# EAGLE design M960-1 (EAGLE 6.6.0)

## Sheet 1 of 2
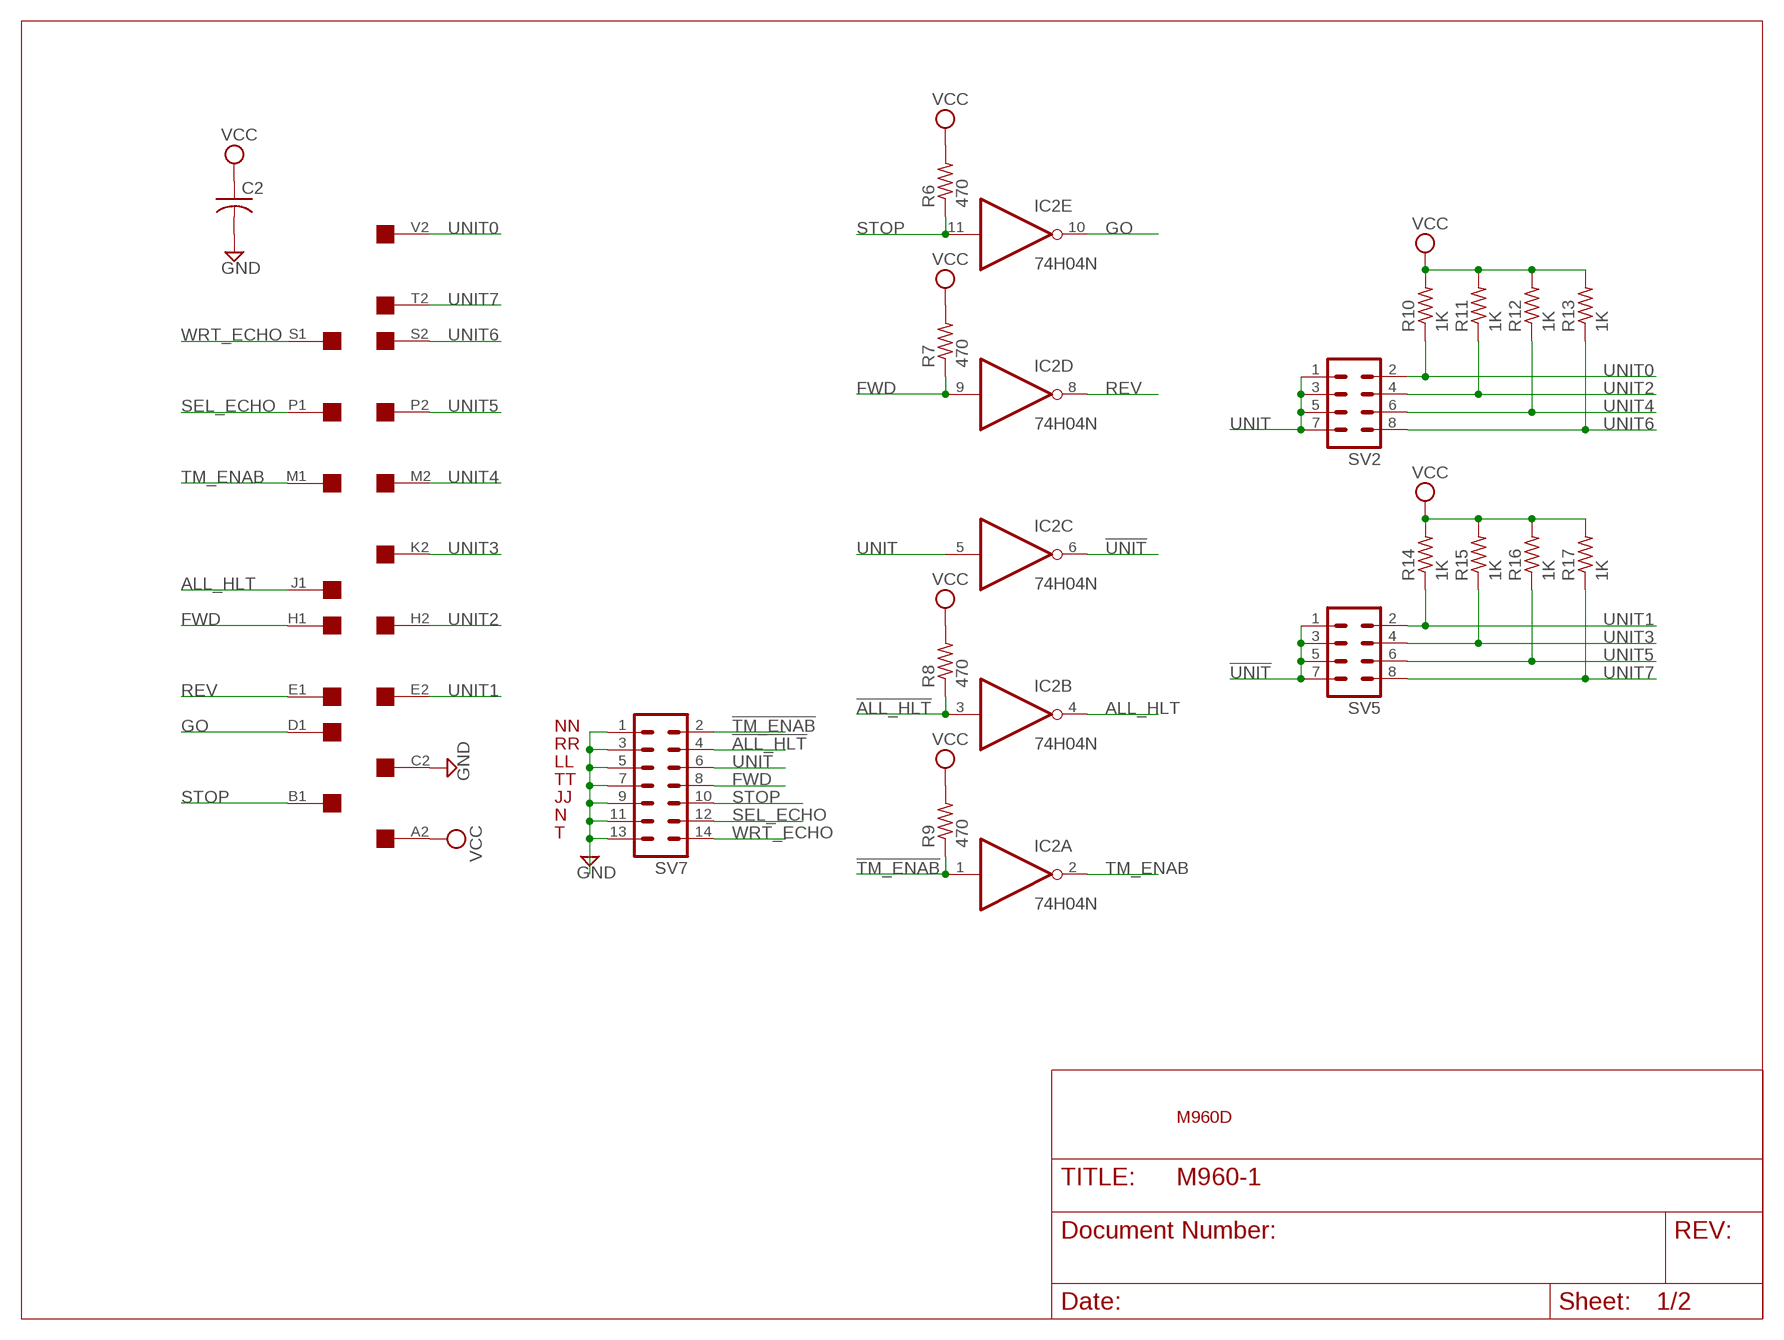
[diagram p0: schematic, sheet 1]

### Parts
C2  C-US050-025X075  [C050-025X075]
IC2  74H04N  7404N  [DIL14]
R6  470  R-US_0207/10  [0207/10]
R7  470  R-US_0207/10  [0207/10]
R8  470  R-US_0207/10  [0207/10]
R9  470  R-US_0207/10  [0207/10]
R10  1K  R-US_0207/10  [0207/10]
R11  1K  R-US_0207/10  [0207/10]
R12  1K  R-US_0207/10  [0207/10]
R13  1K  R-US_0207/10  [0207/10]
R14  1K  R-US_0207/10  [0207/10]
R15  1K  R-US_0207/10  [0207/10]
R16  1K  R-US_0207/10  [0207/10]
R17  1K  R-US_0207/10  [0207/10]
SV2  MA04-2  [MA04-2]
SV5  MA04-2  [MA04-2]
SV7  MA07-2  [MA07-2]
U$3  SINGLE  [EDGE-CON2]

### Nets
!ALL_HLT: IC2.3(B:I) R8.1 SV7.4 ; also sheet 2
!TM_ENAB: IC2.1(A:I) R9.1 SV7.2 ; also sheet 2
!UNIT: IC2.6(C:O) SV5.1 SV5.3 SV5.5 SV5.7
ALL_HLT: IC2.4(B:O) U$3.J1
FWD: IC2.9(D:I) R7.1 SV7.8 U$3.H1 ; also sheet 2
GND: C2.2 SV7.1 SV7.3 SV7.5 SV7.7 SV7.9 SV7.11 SV7.13 U$3.C2 ; also sheet 2
GO: IC2.10(E:O) U$3.D1
REV: IC2.8(D:O) U$3.E1
SEL_ECHO: SV7.12 U$3.P1 ; also sheet 2
STOP: IC2.11(E:I) R6.1 SV7.10 U$3.B1 ; also sheet 2
TM_ENAB: IC2.2(A:O) U$3.M1
UNIT: IC2.5(C:I) SV2.1 SV2.3 SV2.5 SV2.7 SV7.6 ; also sheet 2
UNIT0: R10.1 SV2.2 U$3.V2
UNIT1: R14.1 SV5.2 U$3.E2
UNIT2: R11.1 SV2.4 U$3.H2
UNIT3: R15.1 SV5.4 U$3.K2
UNIT4: R12.1 SV2.6 U$3.M2
UNIT5: R16.1 SV5.6 U$3.P2
UNIT6: R13.1 SV2.8 U$3.S2
UNIT7: R17.1 SV5.8 U$3.T2
VCC: C2.1 R6.2 R7.2 R8.2 R9.2 R10.2 R11.2 R12.2 R13.2 R14.2 R15.2 R16.2 R17.2 U$3.A2 ; also sheet 2
WRT_ECHO: SV7.14 U$3.S1 ; also sheet 2
Unconnected: IC2.12(F:O) IC2.13(F:I) U$3.A1 U$3.B2 U$3.C1 U$3.D2 U$3.F1 U$3.F2 U$3.J2 U$3.K1 U$3.L1 U$3.L2 U$3.N1 U$3.N2 U$3.R1 U$3.R2 U$3.T1 U$3.U1 U$3.U2 U$3.V1

### Notes on the sheet
- NN
- RR
- LL
- TT
- JJ
- N
- T
- M960D

## Sheet 2 of 2
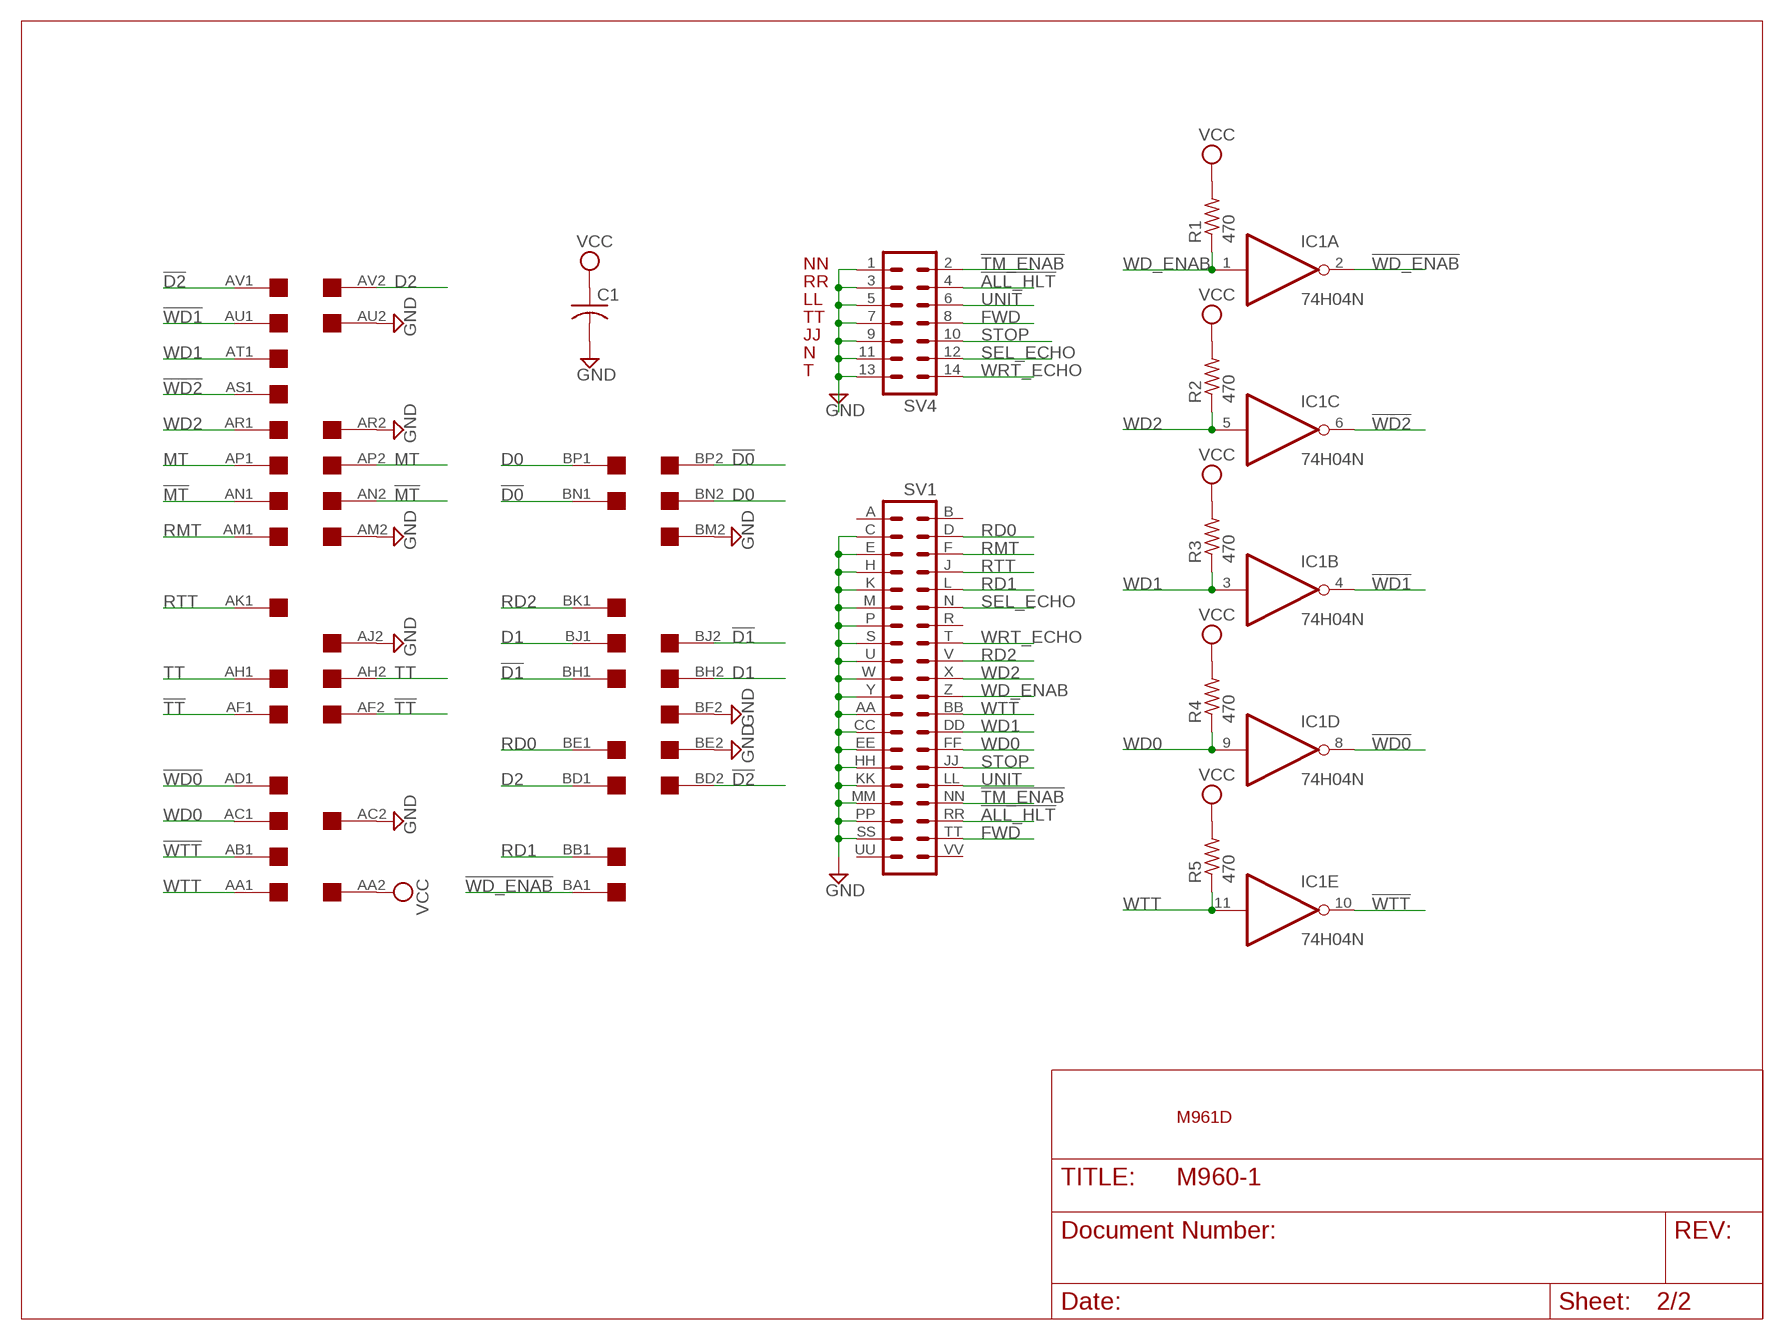
[diagram p1: schematic, sheet 2]

### Parts
C1  C-US050-025X075  [C050-025X075]
EDGE$1  DOUBLE  [EDGE-CON4]
IC1  74H04N  7404N  [DIL14]
R1  470  R-US_0207/10  [0207/10]
R2  470  R-US_0207/10  [0207/10]
R3  470  R-US_0207/10  [0207/10]
R4  470  R-US_0207/10  [0207/10]
R5  470  R-US_0207/10  [0207/10]
SV1  DEC40PINV  [DEC40PINV]
SV4  MA07-2  [MA07-2]

### Nets
!ALL_HLT: SV1.RR SV4.4 ; also sheet 1
!D0: EDGE$1.BN1 EDGE$1.BP2
!D1: EDGE$1.BH1 EDGE$1.BJ2
!D2: EDGE$1.AV1 EDGE$1.BD2
!MT: EDGE$1.AN1 EDGE$1.AN2
!TM_ENAB: SV1.NN SV4.2 ; also sheet 1
!TT: EDGE$1.AF1 EDGE$1.AF2
!WD0: EDGE$1.AD1 IC1.8(D:O)
!WD1: EDGE$1.AU1 IC1.4(B:O)
!WD2: EDGE$1.AS1 IC1.6(C:O)
!WD_ENAB: EDGE$1.BA1 IC1.2(A:O)
!WTT: EDGE$1.AB1 IC1.10(E:O)
D0: EDGE$1.BN2 EDGE$1.BP1
D1: EDGE$1.BH2 EDGE$1.BJ1
D2: EDGE$1.AV2 EDGE$1.BD1
FWD: SV1.TT SV4.8 ; also sheet 1
GND: C1.2 EDGE$1.AC2 EDGE$1.AJ2 EDGE$1.AM2 EDGE$1.AR2 EDGE$1.AU2 EDGE$1.BE2 EDGE$1.BF2 EDGE$1.BM2 SV1.AA SV1.C SV1.CC SV1.E SV1.EE SV1.H SV1.HH SV1.K SV1.KK SV1.M SV1.MM SV1.P SV1.PP SV1.S SV1.SS SV1.U SV1.W SV1.Y SV4.1 SV4.3 SV4.5 SV4.7 SV4.9 SV4.11 SV4.13 ; also sheet 1
MT: EDGE$1.AP1 EDGE$1.AP2
RD0: EDGE$1.BE1 SV1.D
RD1: EDGE$1.BB1 SV1.L
RD2: EDGE$1.BK1 SV1.V
RMT: EDGE$1.AM1 SV1.F
RTT: EDGE$1.AK1 SV1.J
SEL_ECHO: SV1.N SV4.12 ; also sheet 1
STOP: SV1.JJ SV4.10 ; also sheet 1
TT: EDGE$1.AH1 EDGE$1.AH2
UNIT: SV1.LL SV4.6 ; also sheet 1
VCC: C1.1 EDGE$1.AA2 R1.2 R2.2 R3.2 R4.2 R5.2 ; also sheet 1
WD0: EDGE$1.AC1 IC1.9(D:I) R4.1 SV1.FF
WD1: EDGE$1.AT1 IC1.3(B:I) R3.1 SV1.DD
WD2: EDGE$1.AR1 IC1.5(C:I) R2.1 SV1.X
WD_ENAB: IC1.1(A:I) R1.1 SV1.Z
WRT_ECHO: SV1.T SV4.14 ; also sheet 1
WTT: EDGE$1.AA1 IC1.11(E:I) R5.1 SV1.BB
Unconnected: EDGE$1.AB2 EDGE$1.AD2 EDGE$1.AE1 EDGE$1.AE2 EDGE$1.AJ1 EDGE$1.AK2 EDGE$1.AL1 EDGE$1.AL2 EDGE$1.AS2 EDGE$1.AT2 EDGE$1.BA2 EDGE$1.BB2 EDGE$1.BC1 EDGE$1.BC2 EDGE$1.BF1 EDGE$1.BK2 EDGE$1.BL1 EDGE$1.BL2 EDGE$1.BM1 EDGE$1.BR1 EDGE$1.BR2 EDGE$1.BS1 EDGE$1.BS2 EDGE$1.BT1 EDGE$1.BT2 EDGE$1.BU1 EDGE$1.BU2 EDGE$1.BV1 EDGE$1.BV2 IC1.12(F:O) IC1.13(F:I) SV1.A SV1.B SV1.R SV1.UU SV1.VV

### Notes on the sheet
- NN
- RR
- LL
- TT
- JJ
- N
- T
- M961D

## Power pins joined to a net without a drawn wire
GND: IC1.7(P:GND) IC2.7(P:GND)
VCC: IC1.14(P:VCC) IC2.14(P:VCC)

## Library data of the parts
C1 C2 = rcl:C-US: CAPACITOR, American symbol
EDGE$1 = dec-con:DOUBLE: Double-Height DEC board
IC1 IC2 = 74xx-us:74*04: Hex INVERTER
R1-R17 = rcl:R-US_: RESISTOR, American symbol
SV1 = dec-con:DEC40PIN: PIN HEADER
SV2 SV5 = con-lstb:MA04-2: PIN HEADER; OC_FARNELL: unknown; OC_NEWARK: unknown
SV4 SV7 = con-lstb:MA07-2: PIN HEADER; OC_FARNELL: unknown; OC_NEWARK: unknown
U$3 = dec-con:SINGLE: Single-Height DEC board

## Net classes
1 Supply: width 0.813 mm

## Board
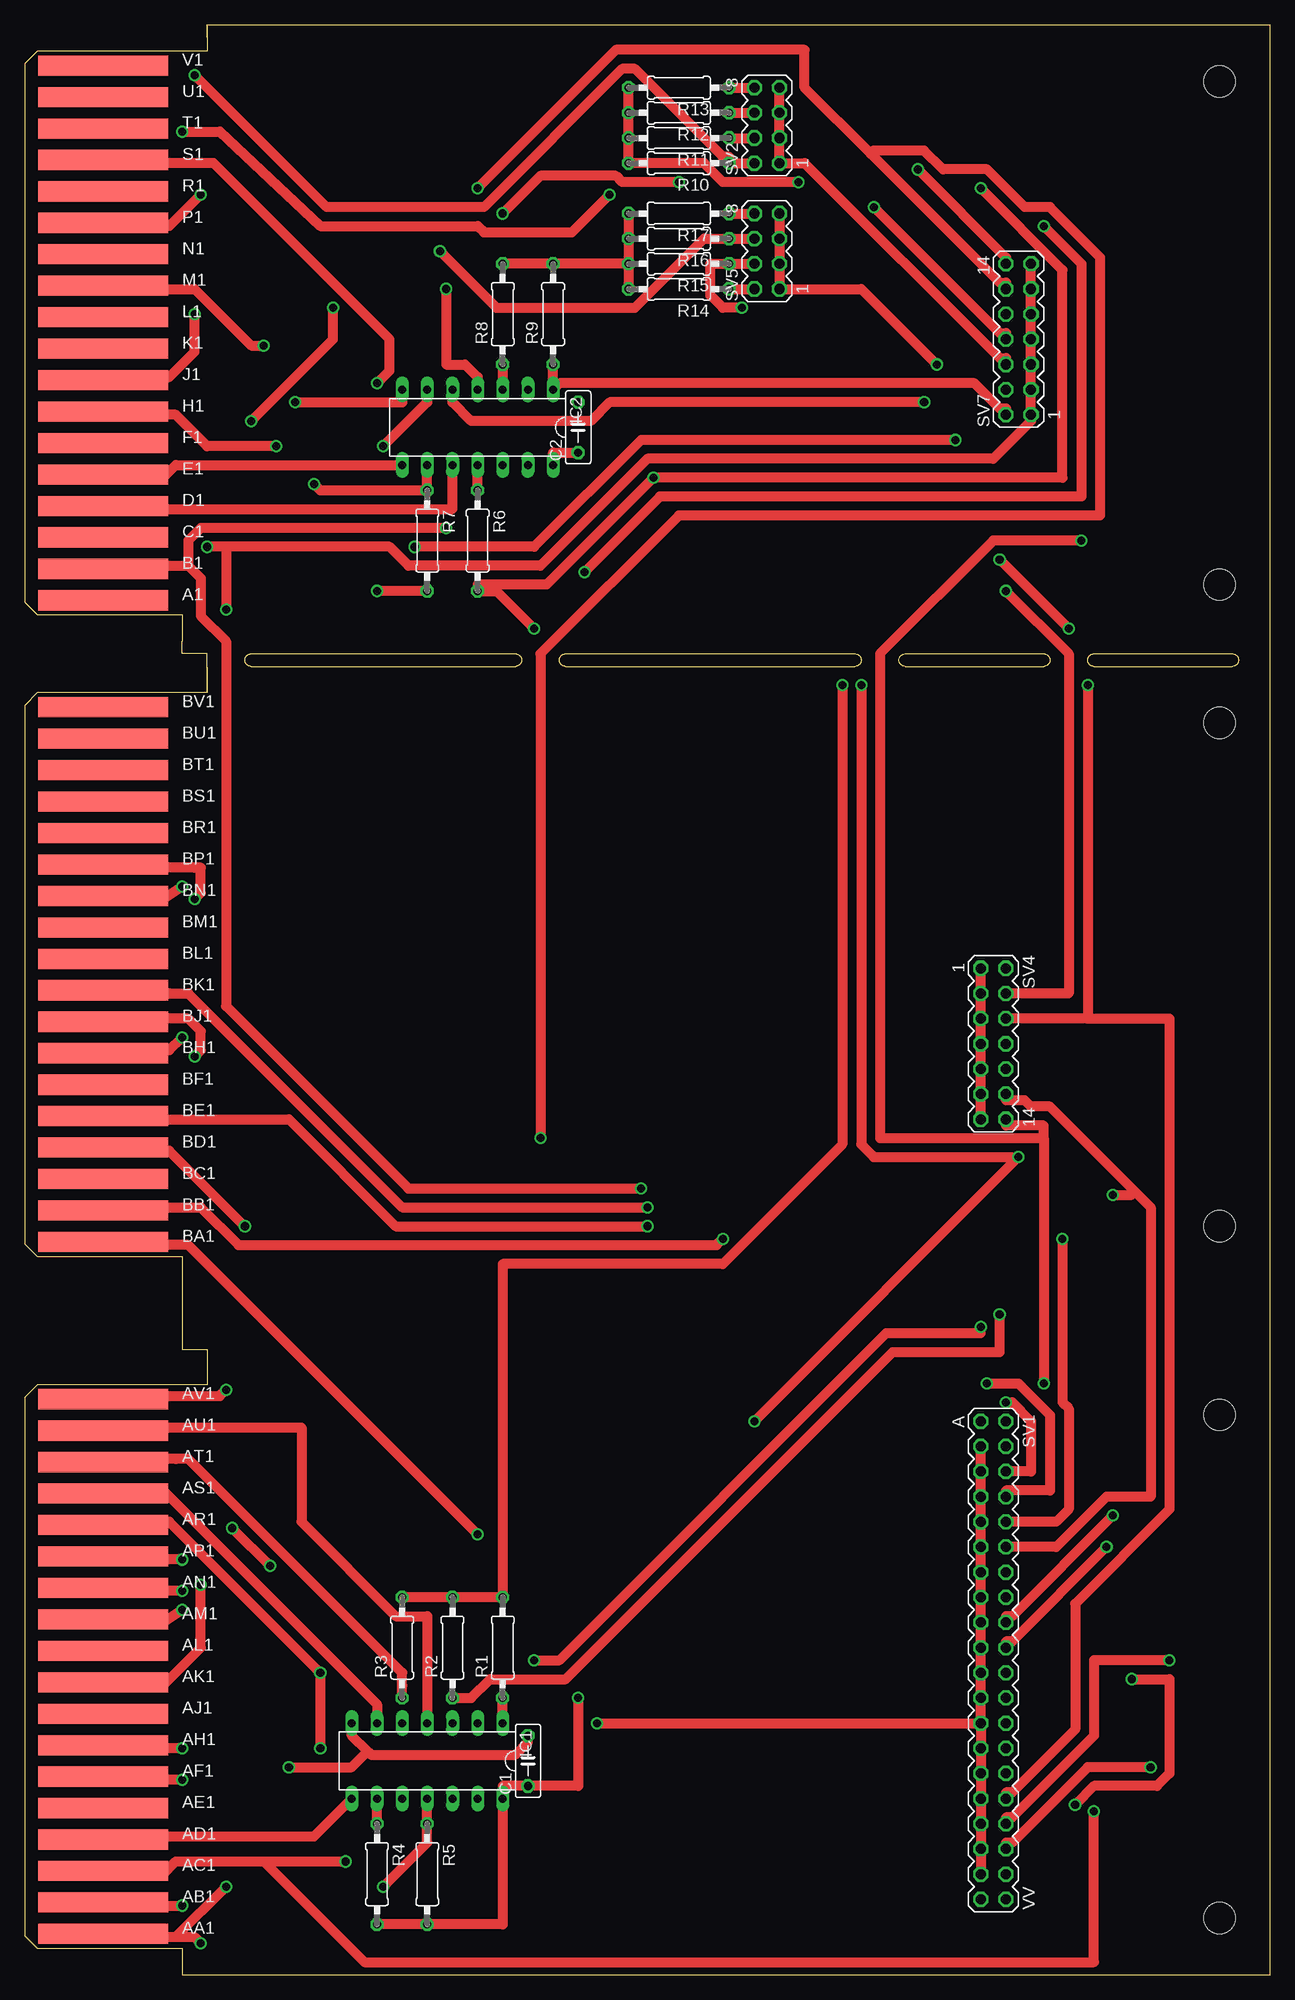
[diagram p2: board, top side]
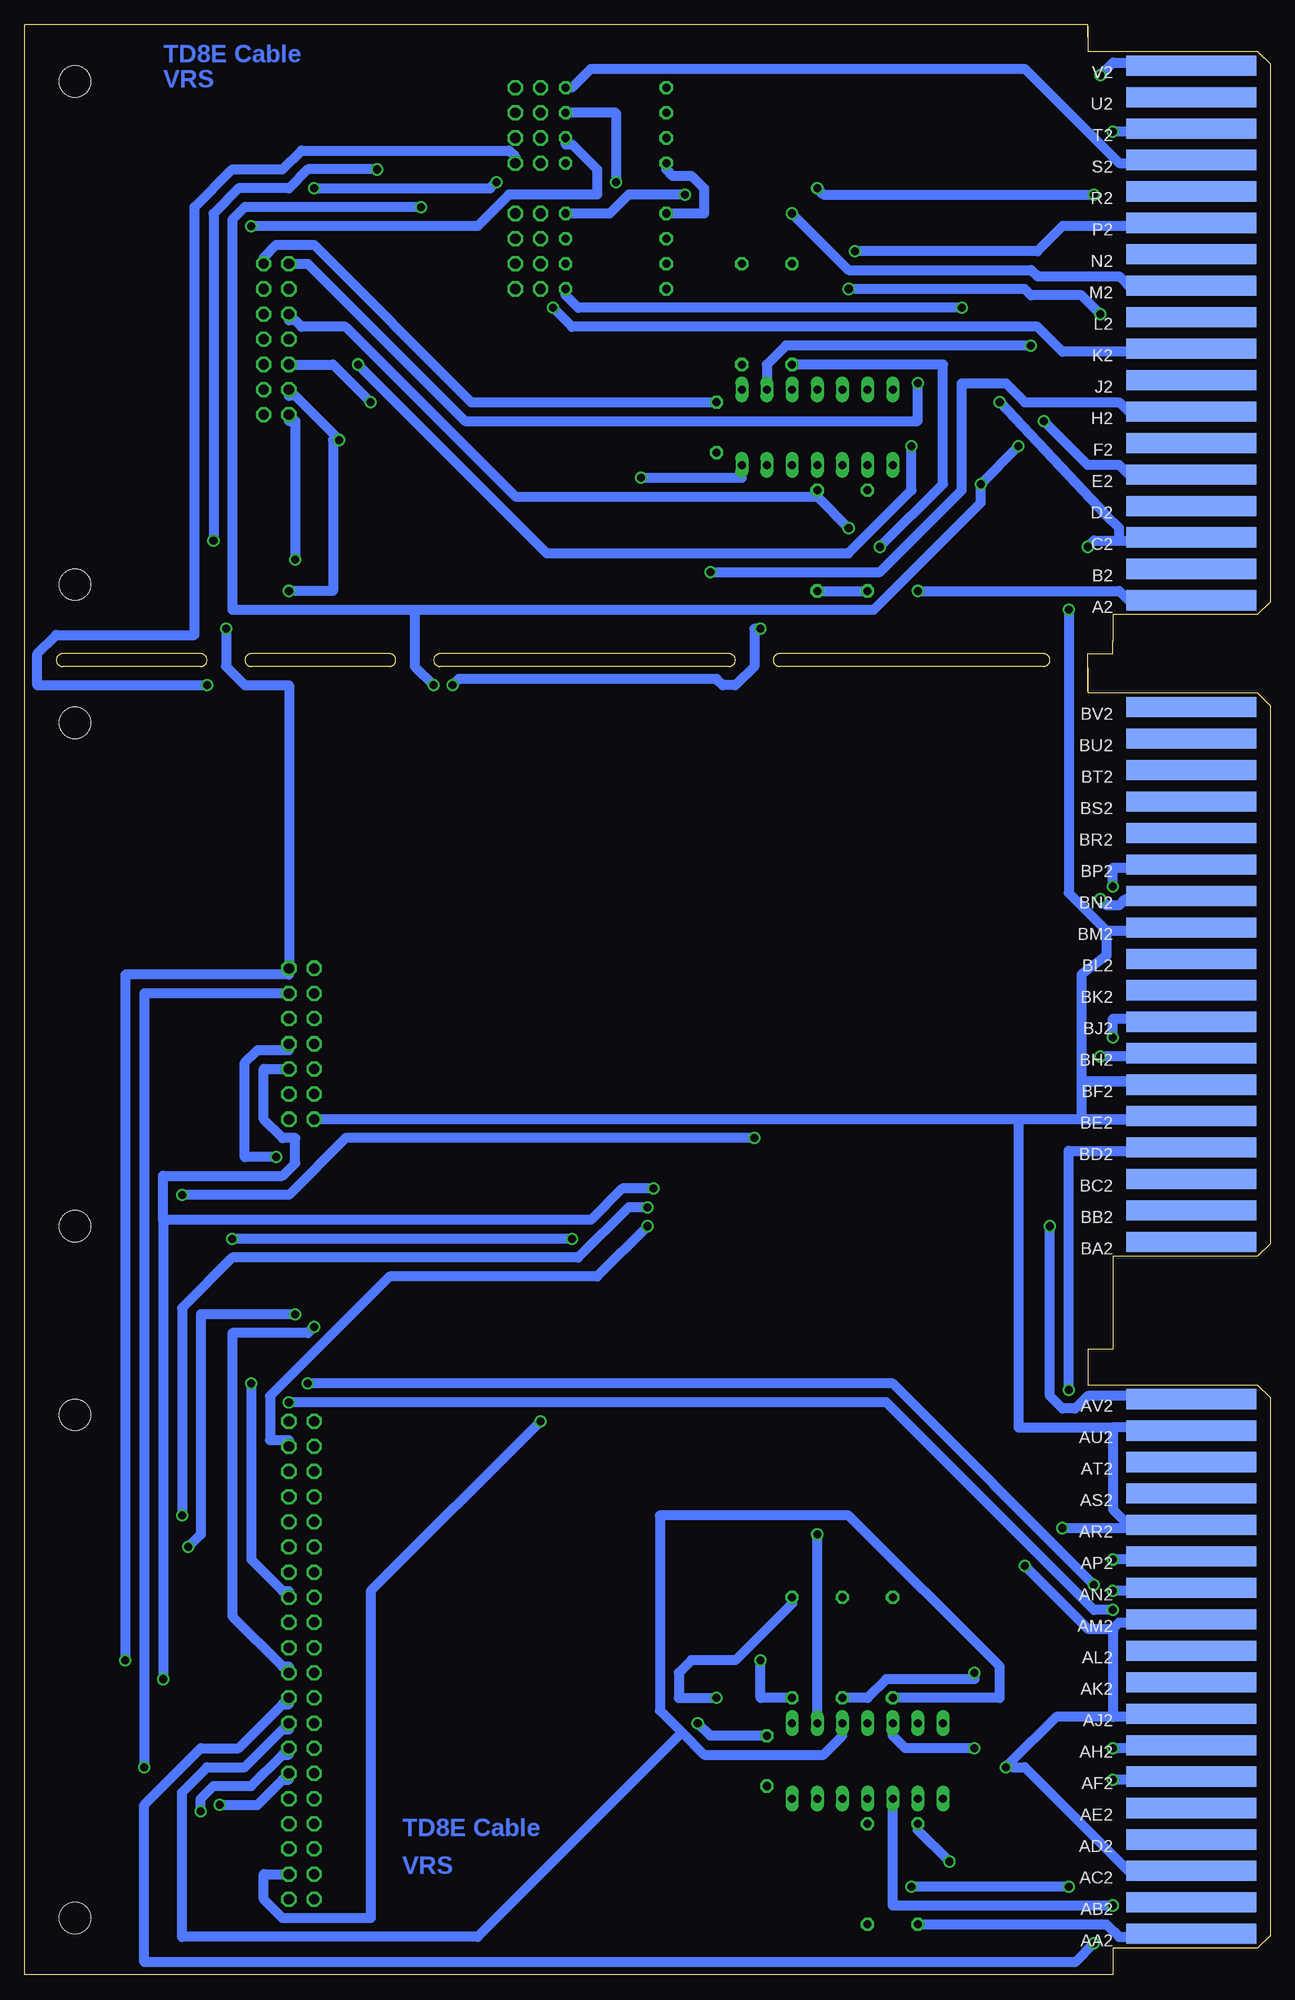
[diagram p3: board, bottom side, seen from below]

Size 125.73 x 196.85 mm. Coordinates in mm from the lower left corner, seen from the top.
Outline: 18.41,195.58 18.41,196.85 125.73,196.85 125.73,0 15.88,0
Outline: 15.88,134.62 15.88,133.35 18.41,133.35 18.41,129.54
Outline: 22.86,133.35 49.53,133.35 arc-180 49.53,132.08 22.86,132.08 arc-180 22.86,133.35
Outline: 54.61,133.35 83.82,133.35 arc-180 83.82,132.08 54.61,132.08 arc-180 54.61,133.35
Outline: 88.9,133.35 102.87,133.35 arc-180 102.87,132.08 88.9,132.08 arc-180 88.9,133.35
Outline: 107.95,133.35 121.92,133.35 arc-180 121.92,132.08 107.95,132.08 arc-180 107.95,133.35
Copper layers (1+16): Top 0.035mm / dielectric 1.5mm / Bottom 0.035mm
Design rules "16mils": minimum track width 16mil, minimum drill 32mil, track to track 15mil, track to pad 10mil, pad to pad 10mil, via to via 10mil, smd to smd 10mil, copper to edge 13mil, drill to drill 10mil, minimum pad ring 10mil, minimum via ring 8mil, stop-mask expansion 0mil, vias tented up to drill 0mil, thermal gap 10mil
Holes 3.17 mm at 120.65,191.13 120.65,140.34 120.65,126.36 120.65,75.56 120.65,56.52 120.65,5.71
tRestrict: area 116.8,137.2 to 125.7,194.3; area 116.8,72.4 to 125.7,129.5; area 116.8,2.5 to 125.7,59.7
bRestrict: area 116.8,137.2 to 125.7,194.3; area 116.8,72.4 to 125.7,129.5; area 116.8,2.5 to 125.7,59.7

### Footprints (pad centres in the part's own frame; a part is rotated, then mirrored left to right if it is on the bottom)
C050-025X075 = drill 0.813 octagon: 1 -2.54,0; 2 2.54,0
EDGE-CON4 = smd 13.106 x 2.032: AA1 7.938,4.128; AB1 7.938,7.303; AC1 7.938,10.477; AD1 7.938,13.652; AE1 7.938,16.828; AF1 7.938,20.003; AH1 7.938,23.177; AJ1 7.938,26.352; AK1 7.938,29.527; AL1 7.938,32.703; AM1 7.938,35.877; AN1 7.938,39.053; AP1 7.938,42.227; AR1 7.938,45.403; AS1 7.938,48.578; AT1 7.938,51.752; AU1 7.938,54.928; AV1 7.938,58.102; BA1 7.938,73.978; BB1 7.938,77.153; BC1 7.938,80.328; BD1 7.938,83.502; BE1 7.938,86.677; BF1 7.938,89.853; BH1 7.938,93.028; BJ1 7.938,96.203; BK1 7.938,99.377; BL1 7.938,102.552; BM1 7.938,105.728; BN1 7.938,108.903; BP1 7.938,112.078; BR1 7.938,115.252; BS1 7.938,118.427; BT1 7.938,121.603; BU1 7.938,124.778; BV1 7.938,127.953 | smd 13.106 x 2.032 bottom: AA2 7.938,4.128; AB2 7.938,7.303; AC2 7.938,10.477; AD2 7.938,13.652; AE2 7.938,16.828; AF2 7.938,20.003; AH2 7.938,23.177; AJ2 7.938,26.352; AK2 7.938,29.527; AL2 7.938,32.703; AM2 7.938,35.877; AN2 7.938,39.053; AP2 7.938,42.227; AR2 7.938,45.403; AS2 7.938,48.578; AT2 7.938,51.752; AU2 7.938,54.928; AV2 7.938,58.102; BA2 7.938,73.978; BB2 7.938,77.153; BC2 7.938,80.328; BD2 7.938,83.502; BE2 7.938,86.677; BF2 7.938,89.853; BH2 7.938,93.028; BJ2 7.938,96.203; BK2 7.938,99.377; BL2 7.938,102.552; BM2 7.938,105.728; BN2 7.938,108.903; BP2 7.938,112.078; BR2 7.938,115.252; BS2 7.938,118.427; BT2 7.938,121.603; BU2 7.938,124.778; BV2 7.938,127.953
DIL14 = drill 0.813 long: 1 -7.62,-3.81; 2 -5.08,-3.81; 3 -2.54,-3.81; 4 0,-3.81; 5 2.54,-3.81; 6 5.08,-3.81; 7 7.62,-3.81; 8 7.62,3.81; 9 5.08,3.81; 10 2.54,3.81; 11 0,3.81; 12 -2.54,3.81; 13 -5.08,3.81; 14 -7.62,3.81
0207/10 = drill 0.813 octagon: 1 -5.08,0; 2 5.08,0
DEC40PINV = drill 1.016 octagon: A -24.13,-1.27; AA 3.81,-1.27; B -24.13,1.27; BB 3.81,1.27; C -21.59,-1.27; CC 6.35,-1.27; D -21.59,1.27; DD 6.35,1.27; E -19.05,-1.27; EE 8.89,-1.27; F -19.05,1.27; FF 8.89,1.27; H -16.51,-1.27; HH 11.43,-1.27; J -16.51,1.27; JJ 11.43,1.27; K -13.97,-1.27; KK 13.97,-1.27; L -13.97,1.27; LL 13.97,1.27; M -11.43,-1.27; MM 16.51,-1.27; N -11.43,1.27; NN 16.51,1.27; P -8.89,-1.27; PP 19.05,-1.27; R -8.89,1.27; RR 19.05,1.27; S -6.35,-1.27; SS 21.59,-1.27; T -6.35,1.27; TT 21.59,1.27; U -3.81,-1.27; UU 24.13,-1.27; V -3.81,1.27; VV 24.13,1.27; W -1.27,-1.27; X -1.27,1.27; Y 1.27,-1.27; Z 1.27,1.27
MA04-2 = drill 1.016 octagon: 1 -3.81,-1.27; 2 -3.81,1.27; 3 -1.27,-1.27; 4 -1.27,1.27; 5 1.27,-1.27; 6 1.27,1.27; 7 3.81,-1.27; 8 3.81,1.27
MA07-2 = drill 1.016 octagon: 1 -7.62,-1.27; 2 -7.62,1.27; 3 -5.08,-1.27; 4 -5.08,1.27; 5 -2.54,-1.27; 6 -2.54,1.27; 7 0,-1.27; 8 0,1.27; 9 2.54,-1.27; 10 2.54,1.27; 11 5.08,-1.27; 12 5.08,1.27; 13 7.62,-1.27; 14 7.62,1.27
EDGE-CON2 = smd 13.106 x 2.032: A1 7.938,4.128; B1 7.938,7.303; C1 7.938,10.477; D1 7.938,13.652; E1 7.938,16.828; F1 7.938,20.003; H1 7.938,23.177; J1 7.938,26.352; K1 7.938,29.527; L1 7.938,32.703; M1 7.938,35.877; N1 7.938,39.053; P1 7.938,42.227; R1 7.938,45.403; S1 7.938,48.578; T1 7.938,51.752; U1 7.938,54.928; V1 7.938,58.102 | smd 13.106 x 2.032 bottom: A2 7.938,4.128; B2 7.938,7.303; C2 7.938,10.477; D2 7.938,13.652; E2 7.938,16.828; F2 7.938,20.003; H2 7.938,23.177; J2 7.938,26.352; K2 7.938,29.527; L2 7.938,32.703; M2 7.938,35.877; N2 7.938,39.053; P2 7.938,42.227; R2 7.938,45.403; S2 7.938,48.578; T2 7.938,51.752; U2 7.938,54.928; V2 7.938,58.102

### Placement (x,y rotation side)
C1  50.8,21.59 90 top
C2  55.88,156.21 90 top
EDGE$1  0,0 0 top
IC1  40.64,21.59 180 top
IC2  45.72,156.21 180 top
R1  48.26,33.02 90 top
R2  43.18,33.02 90 top
R3  38.1,33.02 90 top
R4  35.56,10.16 270 top
R5  40.64,10.16 270 top
R6  45.72,144.78 270 top
R7  40.64,144.78 270 top
R8  48.26,167.64 90 top
R9  53.34,167.64 90 top
R10  66.04,182.88 180 top
R11  66.04,185.42 180 top
R12  66.04,187.96 180 top
R13  66.04,190.5 180 top
R14  66.04,170.18 180 top
R15  66.04,172.72 180 top
R16  66.04,175.26 180 top
R17  66.04,177.8 180 top
SV1  97.79,31.75 270 top
SV2  74.93,186.69 90 top
SV4  97.79,93.98 270 top
SV5  74.93,173.99 90 top
SV7  100.33,165.1 90 top
U$3  0,134.62 0 top

### Tracks (layer width: path | path; a pad name or v marks a point on that pad's centre or on a via)
!ALL_HLT  (via drill 0.81)
  Top 1.016: R8.1 IC2.3 | v93.98,154.94 62.23,154.94 51.44,144.15 v39.37,144.15 | v113.67,20.95 107.31,20.95 99.69,13.34 99.06,13.34 SV1.RR | v99.06,139.7 105.41,133.35 105.41,99.06 SV4.4
  Bottom 1.016: 94.3,155.26 98.42,159.38 99.06,159.38 SV7.4 | 94.3,155.26 v93.98,154.94 | v39.37,144.15 33.02,150.5 33.02,162.56 R8.1 | v113.67,20.95 113.67,99.06 SV4.4 | v99.06,139.7 94.61,139.7 94.61,154.94 94.3,155.26
!D0  (via drill 0.81)
  Top 1.016: v15.88,109.86 13.97,108.58 EDGE$1.BN1
  Bottom 1.016: v15.88,109.86 15.88,111.76 13.97,111.76 EDGE$1.BP2
!D1  (via drill 0.81)
  Top 1.016: v15.88,94.61 14.61,93.34 13.97,93.34 EDGE$1.BH1
  Bottom 1.016: v15.88,94.61 15.88,96.52 13.97,96.52 EDGE$1.BJ2
!D2  (via drill 0.81)
  Top 1.016: v20.32,59.05 19.68,58.42 13.97,58.42 EDGE$1.AV1
  Bottom 1.016: v20.32,59.05 20.32,83.19 13.97,83.19 EDGE$1.BD2
!MT  (via drill 0.81)
  Top 1.016: v15.88,38.73 13.97,38.73 EDGE$1.AN2
  Bottom 1.016: v15.88,38.73 13.97,38.73 EDGE$1.AN2
!TM_ENAB  (via drill 0.81)
  Top 1.016: R9.1 IC2.1 53.98,160.66 95.89,160.66 98.42,158.12 99.06,158.12 SV7.2 | v115.57,31.75 107.95,31.75 107.95,24.13 99.69,15.88 99.06,15.88 SV1.NN | v98.42,142.88 v105.41,135.89
  Bottom 1.016: v115.57,31.75 115.57,100.97 99.06,100.97 SV4.2 99.06,130.18 103.5,130.18 105.41,132.08 v105.41,135.89 | v98.42,142.88 98.42,156.84 99.06,156.84 SV7.2
!TT  (via drill 0.81)
  Top 1.016: v15.88,19.68 13.97,19.68 EDGE$1.AF2
  Bottom 1.016: v15.88,19.68 13.97,19.68 EDGE$1.AF2
!UNIT  (via drill 0.81)
  Top 1.016: v36.2,154.31 40.64,158.75 IC2.6 | v92.08,162.56 84.45,170.18 SV5.1 SV5.3 SV5.5 SV5.7
  Bottom 1.016: v36.2,154.31 36.2,149.86 42.55,143.51 73.03,143.51 v92.08,162.56
!WD0
  Top 1.016: IC1.8 29.21,13.97 13.97,13.97 EDGE$1.AD1
!WD1
  Top 1.016: IC1.4 40.64,36.2 37.47,36.2 27.94,45.72 27.94,55.24 13.97,55.24 EDGE$1.AU1
!WD2
  Top 1.016: IC1.6 35.56,27.3 13.97,48.9 EDGE$1.AS1
!WD_ENAB  (via drill 0.81)
  Top 1.016: v45.72,44.45 16.51,73.66 13.97,73.66 EDGE$1.BA1
  Bottom 1.016: IC1.2 v45.72,44.45
!WTT  (via drill 0.81)
  Top 1.016: v15.88,6.99 13.97,6.99 EDGE$1.AB1
  Bottom 1.016: v15.88,6.99 38.1,6.99 IC1.10
ALL_HLT  (via drill 0.81)
  Top 1.016: v17.14,167.64 17.14,163.83 14.61,161.29 13.97,161.29 U$3.J1 | v42.55,170.18 42.55,162.56 44.45,162.56 45.72,161.29 IC2.4
  Bottom 1.016: v17.14,167.64 19.05,169.54 24.13,169.54 24.77,170.18 v42.55,170.18
D0  (via drill 0.81)
  Top 1.016: v17.14,108.58 17.78,109.22 17.78,111.76 17.14,111.76 13.97,111.76 EDGE$1.BP1
  Bottom 1.016: v17.14,108.58 16.51,107.95 15.24,107.95 14.61,108.58 13.97,108.58 EDGE$1.BN2
D1  (via drill 0.81)
  Top 1.016: v17.14,92.71 17.78,93.34 17.78,95.25 16.51,96.52 13.97,96.52 EDGE$1.BJ1
  Bottom 1.016: v17.14,92.71 13.97,92.71 EDGE$1.BH2
D2  (via drill 0.81)
  Top 1.016: v22.23,75.56 14.61,83.19 13.34,83.19 EDGE$1.BD1
  Bottom 1.016: v22.23,75.56 22.23,58.42 20.95,57.15 19.68,57.15 18.41,58.42 13.34,58.42 EDGE$1.AV2
FWD  (via drill 0.81)
  Top 1.016: v25.4,154.31 18.41,154.31 15.24,157.48 13.97,157.48 U$3.H1 | v29.21,150.5 29.84,149.86 R7.1 IC2.9 | v85.72,178.44 98.42,165.74 99.06,165.74 SV7.8 | 100.01,82.23 v73.66,55.88 | 100.01,82.23 v100.33,82.55 | v84.45,130.18 84.45,83.82 85.72,82.55 99.69,82.55 100.01,82.23
  Bottom 1.016: v25.4,154.31 v29.21,150.5 29.21,148.59 40.01,137.79 86.36,137.79 | v85.72,178.44 103.5,178.44 104.78,177.16 104.78,137.79 86.36,137.79 | v100.33,82.55 103.5,82.55 103.5,92.08 102.23,93.34 99.06,93.34 SV4.8 | v73.66,55.88 90.81,38.73 90.81,5.71 99.69,5.71 101.6,7.62 101.6,10.16 SV1.TT | v84.45,130.18 86.36,132.08 86.36,137.79
GND  (via drill 0.81)
  Top 1.016: SV4.13 SV4.11 SV4.9 SV4.7 SV4.5 SV4.3 SV4.1 | SV1.SS SV1.PP SV1.MM SV1.KK SV1.HH SV1.EE SV1.CC | SV1.CC SV1.AA SV1.Y SV1.W SV1.U SV1.S SV1.P SV1.M SV1.K SV1.H SV1.E SV1.C | 34.61,22.54 33.02,24.13 IC1.7 | 34.61,22.54 34.92,22.23 49.53,22.23 50.8,23.5 C1.2 | v26.67,20.95 33.02,20.95 34.61,22.54 | v20.95,45.09 v24.77,41.27 | v57.78,25.4 SV1.CC | v27.3,158.75 38.1,158.75 IC2.7 | SV7.13 SV7.11 SV7.9 SV7.7 SV7.5 SV7.3 SV7.1 101.6,156.84 97.79,153.03 62.87,153.03 52.07,142.24 38.73,142.24 36.83,144.15 20.32,144.15 | 20.32,144.15 v18.41,144.15 | 20.32,144.15 v20.32,137.79
  Bottom 1.016: 13.97,86.36 19.05,86.36 | 19.05,86.36 25.4,86.36 | 25.4,86.36 SV4.13 | 13.97,86.36 EDGE$1.BE2 13.97,86.36 | 19.05,90.17 19.05,86.36 | 13.97,90.17 EDGE$1.BF2 13.97,90.17 | 13.97,90.17 19.05,90.17 | 19.05,86.36 13.97,86.36 | 16.51,105.41 16.51,102.87 19.05,100.97 19.05,90.17 | 19.05,90.17 13.97,90.17 | 15.88,55.24 15.88,46.99 13.97,45.09 EDGE$1.AR2 13.97,45.72 14.61,45.09 v20.95,45.09 | 15.88,55.24 13.97,55.24 EDGE$1.AU2 | 15.88,34.92 15.88,26.04 | 15.88,34.92 15.24,35.56 13.97,35.56 EDGE$1.AM2 | 13.97,26.04 EDGE$1.AJ2 13.34,26.04 13.97,26.04 | 26.35,21.27 21.59,26.04 15.88,26.04 | 26.35,21.27 v26.67,20.95 | 13.97,26.04 15.88,26.04 | EDGE$1.AC2 13.97,10.16 24.77,20.95 26.04,20.95 26.35,21.27 | v24.77,41.27 18.41,34.92 15.88,34.92 | v57.78,25.4 56.52,24.13 C1.2 | 25.4,86.36 25.4,55.24 15.88,55.24 | 15.24,144.78 15.24,146.05 16.51,147.32 v27.3,158.75 | 13.97,144.78 U$3.C2 12.7,144.78 13.97,144.78 | C2.2 80.64,158.75 96.52,174.62 100.33,174.62 101.6,173.35 SV7.13 | v18.41,144.15 17.78,144.78 15.24,144.78 | 15.24,144.78 13.97,144.78 | 16.51,105.41 13.34,105.41 EDGE$1.BM2 | 16.51,105.41 20.32,109.22 v20.32,137.79
GO
  Top 1.016: IC2.10 43.18,147.96 13.97,147.96 U$3.D1
MT  (via drill 0.81)
  Top 1.016: v15.88,41.91 13.97,41.91 EDGE$1.AP2
  Bottom 1.016: v15.88,41.91 13.97,41.91 EDGE$1.AP2
RD0  (via drill 0.81)
  Top 1.016: v62.87,75.56 37.47,75.56 26.67,86.36 13.34,86.36 EDGE$1.BE1
  Bottom 1.016: v62.87,75.56 67.94,70.48 88.9,70.48 100.97,58.42 100.97,53.98 99.06,53.98 SV1.D
RD1  (via drill 0.81)
  Top 1.016: v70.48,74.3 69.85,73.66 21.59,73.66 17.78,77.47 12.7,77.47 EDGE$1.BB1 | v104.78,74.3 104.78,57.78 105.41,57.15 105.41,46.99 104.14,45.72 SV1.L
  Bottom 1.016: v70.48,74.3 v104.78,74.3
RD2  (via drill 0.81)
  Top 1.016: v62.87,77.47 38.1,77.47 16.51,99.06 14.61,99.06 13.97,99.06 EDGE$1.BK1 | v109.86,46.35 99.69,36.2 99.06,36.2 SV1.V
  Bottom 1.016: v62.87,77.47 64.77,77.47 69.85,72.39 104.78,72.39 109.86,67.31 v109.86,46.35
REV
  Top 1.016: IC2.8 15.24,152.4 13.97,151.13 U$3.E1
RMT  (via drill 0.81)
  Top 1.016: v15.88,36.83 13.97,35.56 EDGE$1.AM1 | v99.06,57.78 99.69,57.78 101.6,55.88 101.6,50.8 SV1.F
  Bottom 1.016: v15.88,36.83 17.78,36.83 38.73,57.78 v99.06,57.78
RTT  (via drill 0.81)
  Top 1.016: v17.78,39.37 17.78,33.02 13.97,29.21 EDGE$1.AK1 | v97.16,59.69 100.33,59.69 103.5,56.52 103.5,48.9 99.06,48.9 SV1.J
  Bottom 1.016: v17.78,39.37 38.1,59.69 v97.16,59.69
SEL_ECHO  (via drill 0.81)
  Top 1.016: 85.41,183.83 98.42,170.81 99.06,170.81 SV7.12 | 85.41,183.83 78.74,190.5 78.74,194.31 59.69,194.31 v45.72,180.34 | v17.78,179.71 14.61,176.53 13.97,176.53 U$3.P1 | 112.08,79.06 113.67,77.47 113.67,48.26 109.22,48.26 104.14,43.18 SV1.N | 112.08,79.06 103.5,87.63 101.6,87.63 100.97,88.27 99.06,88.27 SV4.12 | v52.07,84.45 52.07,133.35 66.04,147.32 108.58,147.32 108.58,173.35 103.5,178.44 100.97,178.44 97.16,182.25 92.71,182.25 90.81,184.15 85.72,184.15 85.41,183.83 | v109.86,78.74 111.76,78.74 112.08,79.06
  Bottom 1.016: v45.72,180.34 45.09,179.71 v17.78,179.71 | v52.07,84.45 93.34,84.45 99.06,78.74 v109.86,78.74
STOP  (via drill 0.81)
  Top 1.016: v106.05,17.14 107.95,19.05 114.3,19.05 115.57,20.32 115.57,29.84 v111.76,29.84 | R6.1 IC2.11 | 16.51,142.24 16.51,144.78 17.78,146.05 v42.55,146.05 | 16.51,142.24 13.97,142.24 U$3.B1 | 16.51,142.24 17.78,140.97 17.78,137.16 20.32,134.62 20.32,97.79 38.73,79.38 v62.23,79.38
  Bottom 1.016: v106.05,17.14 102.23,17.14 99.69,19.68 99.06,19.68 SV1.JJ | 111.76,76.2 v111.76,29.84 | 111.76,76.2 111.76,80.64 99.69,80.64 98.42,81.92 98.42,84.45 99.69,84.45 101.6,86.36 101.6,91.44 SV4.10 | 45.72,149.22 76.2,149.22 93.34,166.37 97.79,166.37 98.42,167 99.06,167 SV7.10 | 45.72,149.22 v42.55,146.05 | 45.72,149.22 R6.1 | v62.23,79.38 65.41,79.38 68.58,76.2 111.76,76.2
TM_ENAB  (via drill 0.81)
  Top 1.016: v24.13,164.47 22.86,164.47 17.14,170.18 13.97,170.18 U$3.M1
  Bottom 1.016: v24.13,164.47 48.9,164.47 50.8,162.56 IC2.2
TT  (via drill 0.81)
  Top 1.016: v15.88,22.86 13.97,22.86 EDGE$1.AH2
  Bottom 1.016: v15.88,22.86 13.97,22.86 EDGE$1.AH2
UNIT  (via drill 0.81)
  Top 1.016: SV7.6 99.06,163.19 98.42,163.19 78.74,182.88 SV2.1 SV2.3 SV2.5 SV2.7 | v90.81,158.75 59.05,158.75 57.15,156.84 45.09,156.84 43.18,158.75 IC2.5 | SV1.LL 99.06,18.41 99.69,18.41 106.05,24.77 106.05,37.47 115.57,46.99 115.57,96.52 107.31,96.52 | 107.31,96.52 SV4.6 | v107.31,130.18 107.31,96.52
  Bottom 1.016: v90.81,158.75 94.61,162.56 SV7.6 | v107.31,130.18 124.46,130.18 124.46,133.35 122.56,135.25 108.58,135.25 108.58,178.44 104.78,182.25 99.69,182.25 97.79,184.15 76.83,184.15 76.2,183.51 SV2.1
UNIT0  (via drill 0.81)
  Top 1.016: v17.14,191.77 30.48,178.44 46.35,178.44 60.33,192.41 61.59,192.41 70.48,183.51 71.12,183.51 R10.1 SV2.2
  Bottom 1.016: v17.14,191.77 15.88,193.04 13.97,193.04 U$3.V2
UNIT1  (via drill 0.81)
  Top 1.016: v22.86,156.84 31.11,165.1 v31.11,168.28 | R14.1 SV5.2
  Bottom 1.016: v22.86,156.84 18.41,152.4 15.24,152.4 13.97,151.13 U$3.E2 | v31.11,168.28 69.85,168.28 71.12,169.54 R14.1
UNIT2  (via drill 0.81)
  Top 1.016: R11.1 SV2.4 | v102.87,176.53 106.68,172.72 106.68,149.22 64.14,149.22 v56.52,141.6
  Bottom 1.016: v102.87,176.53 80.01,176.53 76.83,179.71 67.94,179.71 67.94,182.25 70.48,184.78 71.12,184.78 R11.1 | v56.52,141.6 39.37,141.6 31.11,149.86 31.11,160.66 26.67,160.66 24.77,158.75 15.24,158.75 13.97,157.48 U$3.H2
UNIT3  (via drill 0.81)
  Top 1.016: v72.39,168.28 70.48,168.28 69.22,169.54 69.22,172.72 R15.1 SV5.4
  Bottom 1.016: v72.39,168.28 70.48,166.37 23.5,166.37 20.95,163.83 12.7,163.83 U$3.K2
UNIT4  (via drill 0.81)
  Top 1.016: v48.26,177.8 52.07,181.61 59.69,181.61 60.33,180.97 v66.04,180.97 | R12.1 SV2.6
  Bottom 1.016: v48.26,177.8 42.55,172.09 24.13,172.09 23.5,171.45 15.24,171.45 13.97,170.18 U$3.M2 | v66.04,180.97 66.04,187.96 R12.1
UNIT5  (via drill 0.81)
  Top 1.016: v41.91,173.99 47.62,168.28 61.59,168.28 68.58,175.26 R16.1 SV5.6
  Bottom 1.016: v41.91,173.99 23.5,173.99 20.95,176.53 13.34,176.53 U$3.P2
UNIT6
  Top 1.016: R13.1 SV2.8
  Bottom 1.016: R13.1 70.48,190.5 68.58,192.41 24.77,192.41 15.24,182.88 13.97,182.88 U$3.S2
UNIT7  (via drill 0.81)
  Top 1.016: v15.88,186.06 19.68,186.06 29.84,176.53 45.72,176.53 46.35,175.9 55.24,175.9 v59.05,179.71 | R17.1 SV5.8
  Bottom 1.016: v15.88,186.06 13.97,186.06 U$3.T2 | v59.05,179.71 64.77,179.71 66.67,177.8 R17.1
VCC  (via drill 0.81)
  Top 1.016: R13.2 R12.2 R11.2 R10.2 68.58,182.88 70.48,180.97 v78.11,180.97 | R8.2 R9.2 R15.2 | R15.2 R14.2 | R15.2 R16.2 R17.2 | IC2.14 53.34,153.67 C2.1 | R7.2 v35.56,139.7 | v96.52,180.34 104.78,172.09 104.78,151.13 v63.5,151.13 52.7,140.34 45.72,140.34 R6.2 47.62,139.7 v51.44,135.89 | R3.2 R2.2 R1.2 48.26,71.75 70.48,71.75 82.55,83.82 v82.55,130.18 | R4.2 R5.2 48.26,5.08 IC1.14 48.26,19.05 C1.1 55.88,19.05 v55.88,27.94
  Bottom 1.016: R10.2 60.96,182.25 60.33,181.61 58.42,181.61 57.15,180.34 57.15,177.8 R17.2 | v35.56,139.7 15.24,139.7 13.97,138.43 U$3.A2 | R6.2 R7.2 | v63.5,151.13 53.34,151.13 IC2.14 | v78.11,180.97 78.74,180.34 v96.52,180.34 | EDGE$1.AA2 13.97,3.81 15.24,3.81 16.51,5.08 R4.2 | v55.88,27.94 59.69,27.94 59.69,30.48 58.42,31.75 53.98,31.75 48.26,37.47 R1.2 | v82.55,130.18 81.92,130.81 55.88,130.81 55.24,130.18 53.98,130.18 52.07,132.08 52.07,135.89 v51.44,135.89
WD0  (via drill 0.81)
  Top 1.016: 24.13,11.43 v32.38,11.43 | 24.13,11.43 15.24,11.43 13.97,10.16 EDGE$1.AC1 | R4.1 IC1.9 | v107.95,16.51 107.95,1.27 34.29,1.27 24.13,11.43
  Bottom 1.016: v32.38,11.43 35.56,14.61 R4.1 | v107.95,16.51 107.95,17.78 106.68,19.05 102.87,19.05 99.69,22.23 99.06,22.23 SV1.FF
WD1
  Top 1.016: EDGE$1.AT1 12.7,52.07 15.24,52.07 16.51,52.07 38.1,30.48 38.1,29.21 R3.1
  Bottom 1.016: 59.37,24.45 61.59,26.67 61.59,46.35 42.55,46.35 27.3,31.11 27.3,27.94 R3.1 | 59.37,24.45 57.15,22.23 45.09,22.23 43.18,24.13 IC1.3 | SV1.DD 99.06,24.77 99.69,24.77 103.5,20.95 107.31,20.95 109.86,18.41 109.86,3.81 80.01,3.81 59.37,24.45
WD2  (via drill 0.81)
  Top 1.016: EDGE$1.AR1 14.61,45.72 v29.84,30.48 v29.84,22.86 | v109.22,43.18 99.69,33.66 99.06,33.66 SV1.X | v98.42,66.67 98.42,62.87 87.63,62.87 54.61,29.84 46.99,29.84 45.09,27.94 R2.1
  Bottom 1.016: v29.84,30.48 29.84,29.84 38.73,29.84 40.64,27.94 R2.1 | v29.84,22.86 36.83,22.86 38.1,24.13 IC1.5 | v109.22,43.18 107.95,44.45 107.95,66.67 v98.42,66.67
WD_ENAB  (via drill 0.81)
  Top 1.016: IC1.1 R1.1 | v96.52,65.41 96.52,64.77 87,64.77 53.98,31.75 v51.44,31.75
  Bottom 1.016: v96.52,65.41 97.16,64.77 104.78,64.77 104.78,36.2 99.69,31.11 99.06,31.11 SV1.Z | v51.44,31.75 51.44,27.94 R1.1
WRT_ECHO  (via drill 0.81)
  Top 1.016: v35.56,160.66 36.83,161.93 36.83,165.1 19.05,182.88 13.34,182.88 U$3.S1 | 102.87,84.45 v102.87,59.69 | 102.87,84.45 102.87,85.72 99.06,85.72 SV4.14 | v90.17,182.25 99.06,173.35 SV7.14 | v106.68,144.78 97.79,144.78 86.36,133.35 86.36,84.45 102.87,84.45
  Bottom 1.016: v35.56,160.66 35.56,156.84 81.28,156.84 97.16,172.72 SV7.14 | v102.87,59.69 102.87,41.91 99.69,38.73 99.06,38.73 SV1.T | v90.17,182.25 97.16,182.25 99.06,180.34 104.14,180.34 106.68,177.8 v106.68,144.78
WTT  (via drill 0.81)
  Top 1.016: 13.97,3.81 12.7,3.81 EDGE$1.AA1 13.97,3.81 | 15.24,3.81 v20.32,8.89 | v36.2,8.89 40.64,13.34 R5.1 IC1.11 | v17.78,3.17 17.14,3.81 15.24,3.81 | 13.97,3.81 15.24,3.81
  Bottom 1.016: v20.32,8.89 v36.2,8.89 | v17.78,3.17 19.68,1.27 113.67,1.27 113.67,17.14 107.95,22.86 104.14,22.86 99.69,27.3 99.06,27.3 SV1.BB

### Text on the board
Bottom: TD8E Cable | VRS | TD8E Cable | VRS
tValues: Unit6 | Unit4 | Unit2 | Unit0 | Unit7 | Unit5 | Unit3 | Unit1